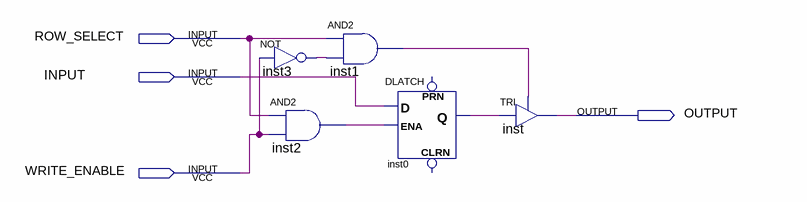
[diagram p0: schematic sheet]
// Quartus schematic MC.bdf as structural Verilog: 5 symbols, 4 pins
module MC (
  input  ROW_SELECT,
  input  INPUT,
  input  WRITE_ENABLE,
  output OUTPUT
);

  wire inst0_q, inst1_out, inst2_out, inst3_out;

  not inst3 (inst3_out, WRITE_ENABLE);
  and inst2 (inst2_out, ROW_SELECT, WRITE_ENABLE);
  and inst1 (inst1_out, ROW_SELECT, inst3_out);
  DLATCH inst0 (.D(INPUT), .ENA(inst2_out), .Q(inst0_q));  // open: CLRN, PRN
  TRI inst (.IN(inst0_q), .OE(inst1_out), .OUT(OUTPUT));
endmodule
